# Altium schematic sheet project.SchDoc
size A4
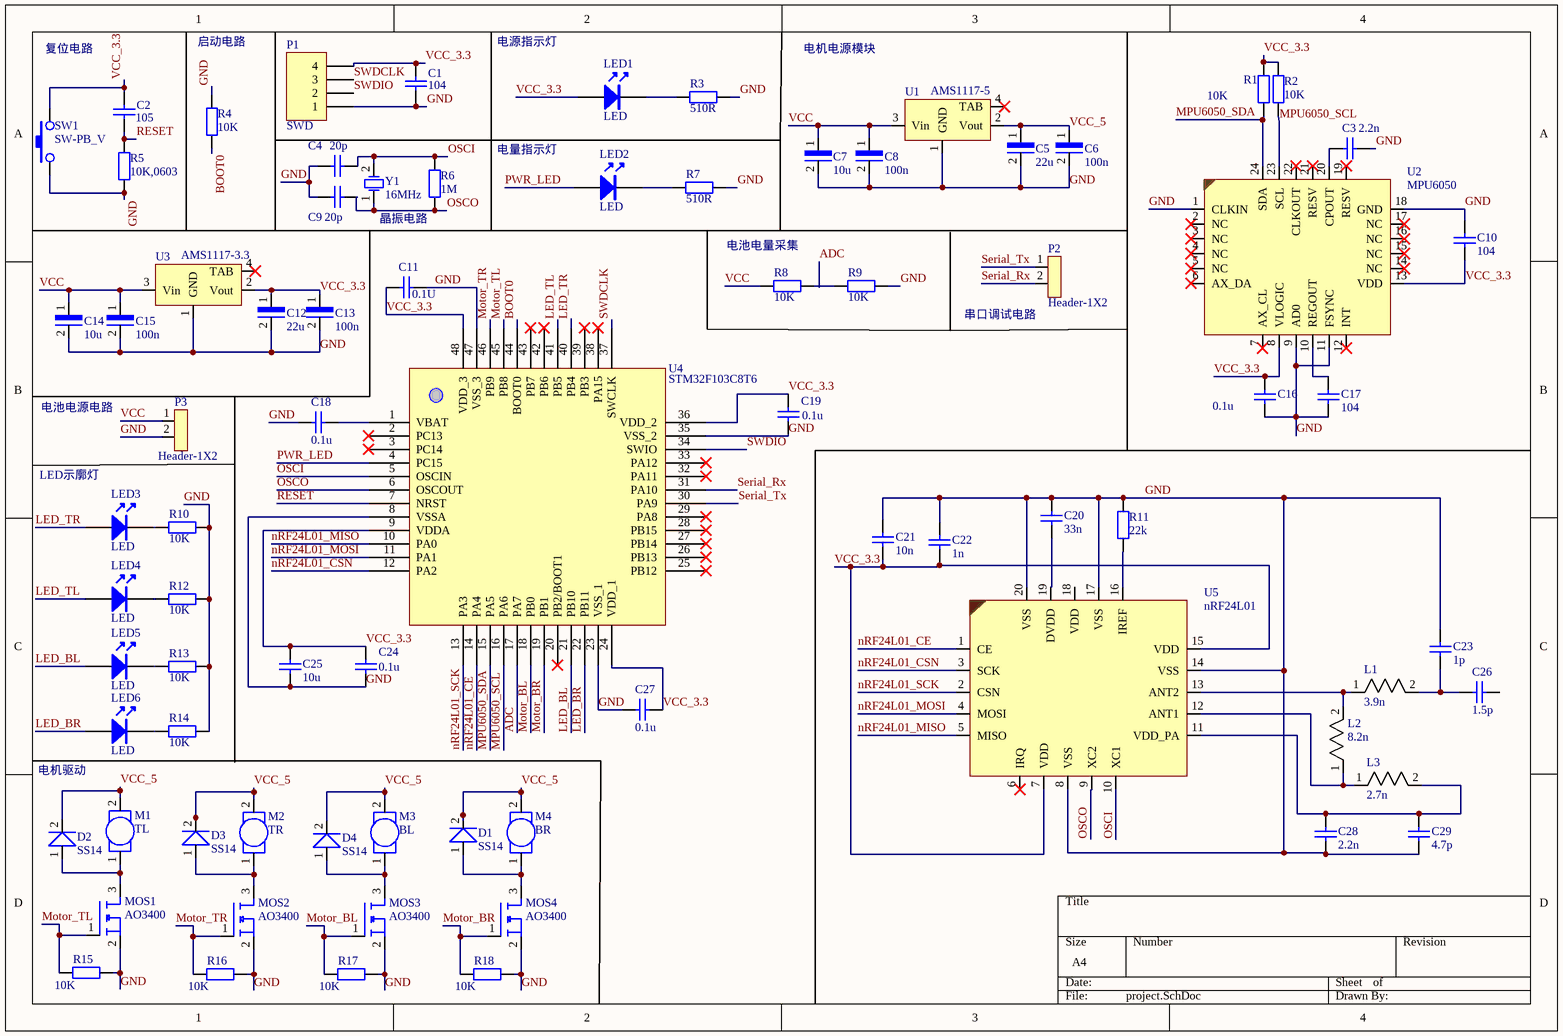
[diagram p0: project.SchDoc]

## Parts
C1  104  [C0603]
C2  105  [C0603]
C3  2.2n  [C0603]
C4  20p  [C0603]
C5  22u  [C0603]
C6  100n  [C0603]
C7  10u  [C0603]
C8  100n  [C0603]
C9  20p  [C0603]
C10  104  [C0603]
C11  0.1U  [C0603]
C12  22u  [C0603]
C13  100n  [C0603]
C14  10u  [C0603]
C15  100n  [C0603]
C16  0.1u  [C0603]
C17  104  [C0603]
C18  0.1u  [C0603]
C19  0.1u  [C0603]
C20  33n  [C0603]
C21  10n  [C0603]
C22  1n  [C0603]
C23  1p  [C0603]
C24  0.1u  [C0603]
C25  10u  [C0603]
C26  1.5p  [C0603]
C27  0.1u  [C0603]
C28  2.2n  [C0603]
C29  4.7p  [C0603]
D1  SS14  [D0603]
D2  SS14  [D0603]
D3  SS14  [D0603]
D4  SS14  [D0603]
L1  3.9n  [L0603]
L2  8.2n  [L0603]
L3  2.7n  [L0603]
LED1  LED  [LED]
LED2  LED  [LED]
LED3  LED  [LED]
LED4  LED  [LED]
LED5  LED  [LED]
LED6  LED  [LED]
M1  TL  [HDR-1X2]
M2  TR  [HDR-1X2]
M3  BL  [HDR-1X2]
M4  BR  [HDR-1X2]
MOS1  AO3400  [SOT-23]
MOS2  AO3400  [SOT-23]
MOS3  AO3400  [SOT-23]
MOS4  AO3400  [SOT-23]
P1  SWD  [HDR1X4]
P2  Header-1X2  [HDR-1X2]
P3  Header-1X2  [HDR-1X2]
R1  10K  [R0603]
R2  10K  [R0603]
R3  510R  [R0603]
R4  10K  [R0603]
R5  10K,0603  [R0603]
R6  1M  [R0603]
R7  510R  [R0603]
R8  10K  [R0603]
R9  10K  [R0603]
R10  10K  [R0603]
R11  22k  [R0603]
R12  10K  [R0603]
R13  10K  [R0603]
R14  10K  [R0603]
R15  10K  [R0603]
R16  10K  [R0603]
R17  10K  [R0603]
R18  10K  [R0603]
SW1  SW-PB_V  [KEY-SMT]
U1  AMS1117-5  [SOT-223-L]
U2  MPU6050  [QFN-24-4X4-L]
U3  AMS1117-3.3  [SOT-223-L]
U4  STM32F103C8T6  [LQFP-48-5X5]
U5  nRF24L01  [QFN-20-3X3-L]
Y1  16MHz  [XTAL1]

## Nets
ADC: U4.17(PA7)
BOOT0: R4.1 U4.44(BOOT0)
GND: C1.1 C3.1 C4.1 C5.2 C6.2 C7.2 C8.2 C9.1 C10.2 C11.2 C12.2 C13.2 C14.2 C15.2 C16.1 C17.2 C18.1 C19.1 C20.2 C21.2 C22.2 C23.2 C24.1 C25.1 C27.1 C28.1 C29.1 MOS1.2 MOS2.2 MOS3.2 MOS4.2 P1.1 P3.2 R3.2 R4.2 R5.1 R7.2 R9.2 R10.2 R11.2 R12.2 R13.2 R14.2 R15.2 R16.2 R17.2 R18.2 SW1.1 U1.1(GND) U2.1(CLKIN) U2.9(AD0) U2.11(FSYNC) U2.18(GND) U3.1(GND) U4.8(VSSA) U4.23(VSS_1) U4.35(VSS_2) U4.47(VSS_3) U5.8(VSS) U5.14(VSS) U5.17(VSS) U5.20(VSS)
LED_BL: LED5.D U4.21(PB10)
LED_BR: LED6.D U4.22(PB11)
LED_TL: LED4.D U4.41(PB5)
LED_TR: LED3.D U4.40(PB4)
Motor_BL: MOS3.1 R17.1 U4.18(PB0)
Motor_BR: MOS4.1 R18.1 U4.19(PB1)
Motor_TL: MOS1.1 R15.1 U4.45(PB8)
Motor_TR: MOS2.1 R16.1 U4.46(PB9)
MPU6050_SCL: R2.1 U2.23(SCL) U4.16(PA6)
MPU6050_SDA: R1.1 U2.24(SDA) U4.15(PA5)
nRF24L01_CE: U4.14(PA4) U5.1(CE)
nRF24L01_CSN: U4.12(PA2) U5.3(SCK)
nRF24L01_MISO: U4.10(PA0) U5.5(MISO)
nRF24L01_MOSI: U4.11(PA1) U5.4(MOSI)
nRF24L01_SCK: U4.13(PA3) U5.2(CSN)
OSCI: C4.2 R6.2 U4.5(OSCIN) U5.10(XC1) Y1.2(OSC2)
OSCO: C9.2 R6.1 U4.6(OSCOUT) U5.9(XC2) Y1.1
PWR_LED: LED2.D U4.4(PC15)
RESET: C2.1 R5.2 U4.7(NRST)
Serial_Rx: P2.2 U4.31(PA10)
Serial_Tx: P2.1 U4.30(PA9)
SWDCLK: P1.3 U4.37(SWCLK)
SWDIO: P1.2 U4.34(SWIO)
VCC: C7.1 C8.1 C14.1 C15.1 P3.1 R8.1 U1.3(Vin) U3.3(Vin)
VCC_3.3: C1.2 C2.2 C11.1 C12.1 C13.1 C16.2 C19.2 C21.1 C22.1 C24.2 C25.2 C27.2 LED1.D P1.4 R1.2 R2.2 SW1.2 U2.8(VLOGIC) U3.2(Vout) U4.9(VDDA) U4.24(VDD_1) U4.36(VDD_2) U4.48(VDD_3) U5.7(VDD) U5.15(VDD)
VCC_5: C5.1 C6.1 D1.2 D2.2 D3.2 D4.2 M1.2 M2.2 M3.2 M4.2 U1.2(Vout)
NetC3_2: C3.2 U2.20(CPOUT)
NetC10_1: C10.1 U2.13(VDD)
NetC17_1: C17.1 U2.10(REGOUT)
NetC18_2: C18.2 U4.1(VBAT)
NetC20_1: C20.1 U5.19(DVDD)
NetC23_1: C23.1 C26.1 L1.2
NetC28_2: C28.2 C29.2 L3.2 U5.11(VDD_PA)
NetD1_1: D1.1 M4.1 MOS4.3
NetD2_1: D2.1 M1.1 MOS1.3
NetD3_1: D3.1 M2.1 MOS2.3
NetD4_1: D4.1 M3.1 MOS3.3
NetL1_1: L1.1 L2.2 U5.13(ANT2)
NetL2_1: L2.1 L3.1 U5.12(ANT1)
NetLED1_K: LED1.K R3.1
NetLED2_K: LED2.K R7.1
NetLED3_K: LED3.K R10.1
NetLED4_K: LED4.K R12.1
NetLED5_K: LED5.K R13.1
NetLED6_K: LED6.K R14.1
NetR8_2: R8.2 R9.1
NetR11_1: R11.1 U5.16(IREF)

Not connected (* = marked no-connect by the designer): C26 2; U1 4(TAB)*; U2 2(NC)* 3(NC)* 4(NC)* 5(NC)* 6(AX_DA)* 7(AX_CL)* 12(INT)* 14(NC)* 15(NC)* 16(NC)* 17(NC)* 19(RESV)* 21(RESV)* 22(CLKOUT)*; U3 4(TAB)*; U4 2(PC13)* 3(PC14)* 20(PB2/BOOT1)* 25(PB12)* 26(PB13)* 27(PB14)* 28(PB15)* 29(PA8)* 32(PA11)* 33(PA12)* 38(PA15)* 39(PB3)* 42(PB6)* 43(PB7)*; U5 6(IRQ)* 18(VDD)

## Notes on the sheet
- 启动电路
- 电源指示灯
- 复位电路
- 电机电源模块
- 电量指示灯
- 晶振电路
- 电池电量采集
- 串口调试电路
- 电池电源电路
- LED示廓灯
- 电机驱动
- Labels drawn without touching a wire or pin: VCC_3.3

## Library data of the parts
C1 C10 C17 = CAP: Capacitor; Published: 8-Jun-2000; LatestRevisionDate: 17-Jul-2002; LatestRevisionNote: Re-released for DXP Platform.; Publisher: Altium Limited; Value: 104
C2-C4 C9 C11 C16 C18-C29 = CAP: Capacitor; Value: 104; Published: 8-Jun-2000; LatestRevisionDate: 17-Jul-2002; LatestRevisionNote: Re-released for DXP Platform.; Publisher: Altium Limited
C5-C8 C12-C15 = CAPP
D1-D4 = Diode
L1-L3 = Inductance
LED1-LED6 = LED: pin to pad: D>1 K>2
M1-M4 = Motor
P1 = Header 4: Header, 4-Pin; LatestRevisionDate: 17-Jul-2002; LatestRevisionNote: Re-released for DXP Platform.; Publisher: Altium Limited
R1-R18 = RES: Resistor; Published: 8-Jun-2000; LatestRevisionDate: 17-Jul-2002; LatestRevisionNote: Re-released for DXP Platform.; Publisher: Altium Limited
SW1 = SW-PB_V: SWITCH
U1 U3 = AMS1117
Y1 = XTAL: Crystal Oscillator; Published: 8-Jun-2000; LatestRevisionDate: 17-Jul-2002; LatestRevisionNote: Re-released for DXP Platform.; Publisher: Altium Limited